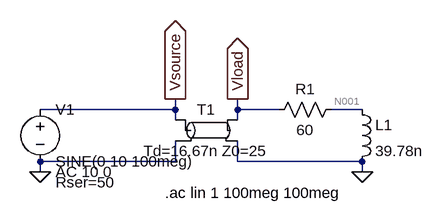
[diagram p0: schematic Q2.asc]
Q2.asc, the LTspice schematic file:
Version 4
SHEET 1 880 680
WIRE 224 144 224 128
WIRE 224 144 16 144
WIRE 320 144 320 128
WIRE 384 144 320 144
WIRE 512 144 464 144
WIRE 224 160 224 144
WIRE 320 160 320 144
WIRE 224 224 224 192
WIRE 224 224 16 224
WIRE 320 224 320 192
WIRE 512 224 320 224
WIRE 16 240 16 224
WIRE 512 240 512 224
FLAG 16 240 0
FLAG 224 128 Vsource
IOPIN 224 128 Out
FLAG 320 128 Vload
IOPIN 320 128 Out
FLAG 512 240 0
SYMBOL tline 272 176 R0
SYMATTR InstName T1
SYMATTR Value Td=16.67n Z0=25
SYMBOL voltage 16 128 R0
WINDOW 123 24 112 Left 2
WINDOW 39 24 128 Left 2
SYMATTR Value2 AC 10 0
SYMATTR SpiceLine Rser=50
SYMATTR InstName V1
SYMATTR Value SINE(0 10 100meg)
SYMBOL res 480 128 R90
WINDOW 0 0 56 VBottom 2
WINDOW 3 32 56 VTop 2
SYMATTR InstName R1
SYMATTR Value 60
SYMBOL ind 496 128 R0
SYMATTR InstName L1
SYMATTR Value 39.78n
TEXT 208 272 Left 2 !.ac lin 1 100meg 100meg

The netlist it stands for:
* Q2.asc
T1 Vsource 0 Vload 0 Td=16.67n Z0=25
V1 Vsource 0 SINE(0 10 100meg) AC 10 0 Rser=50
R1 N001 Vload 60
L1 N001 0 39.78n
.ac lin 1 100meg 100meg
.backanno
.end

* Results of the author's LTspice run, read from the files saved beside the schematic
* AC Analysis:
*   frequency = 100 M
*   V(vsource) = 2.631 V
*   V(vload) = -2.154 V
*   V(n001) = -1.797 V
*   I(L1) = -5.959 mA
*   I(R1) = 5.959 mA
*   Ia(T1) = 147.4 mA
*   Ib(T1) = 5.959 mA
*   Ic(T1) = -147.4 mA
*   Id(T1) = -5.959 mA
*   I(V1) = -147.4 mA